# EAGLE design hat (EAGLE 7.7.0)

## Sheet 1 of 2
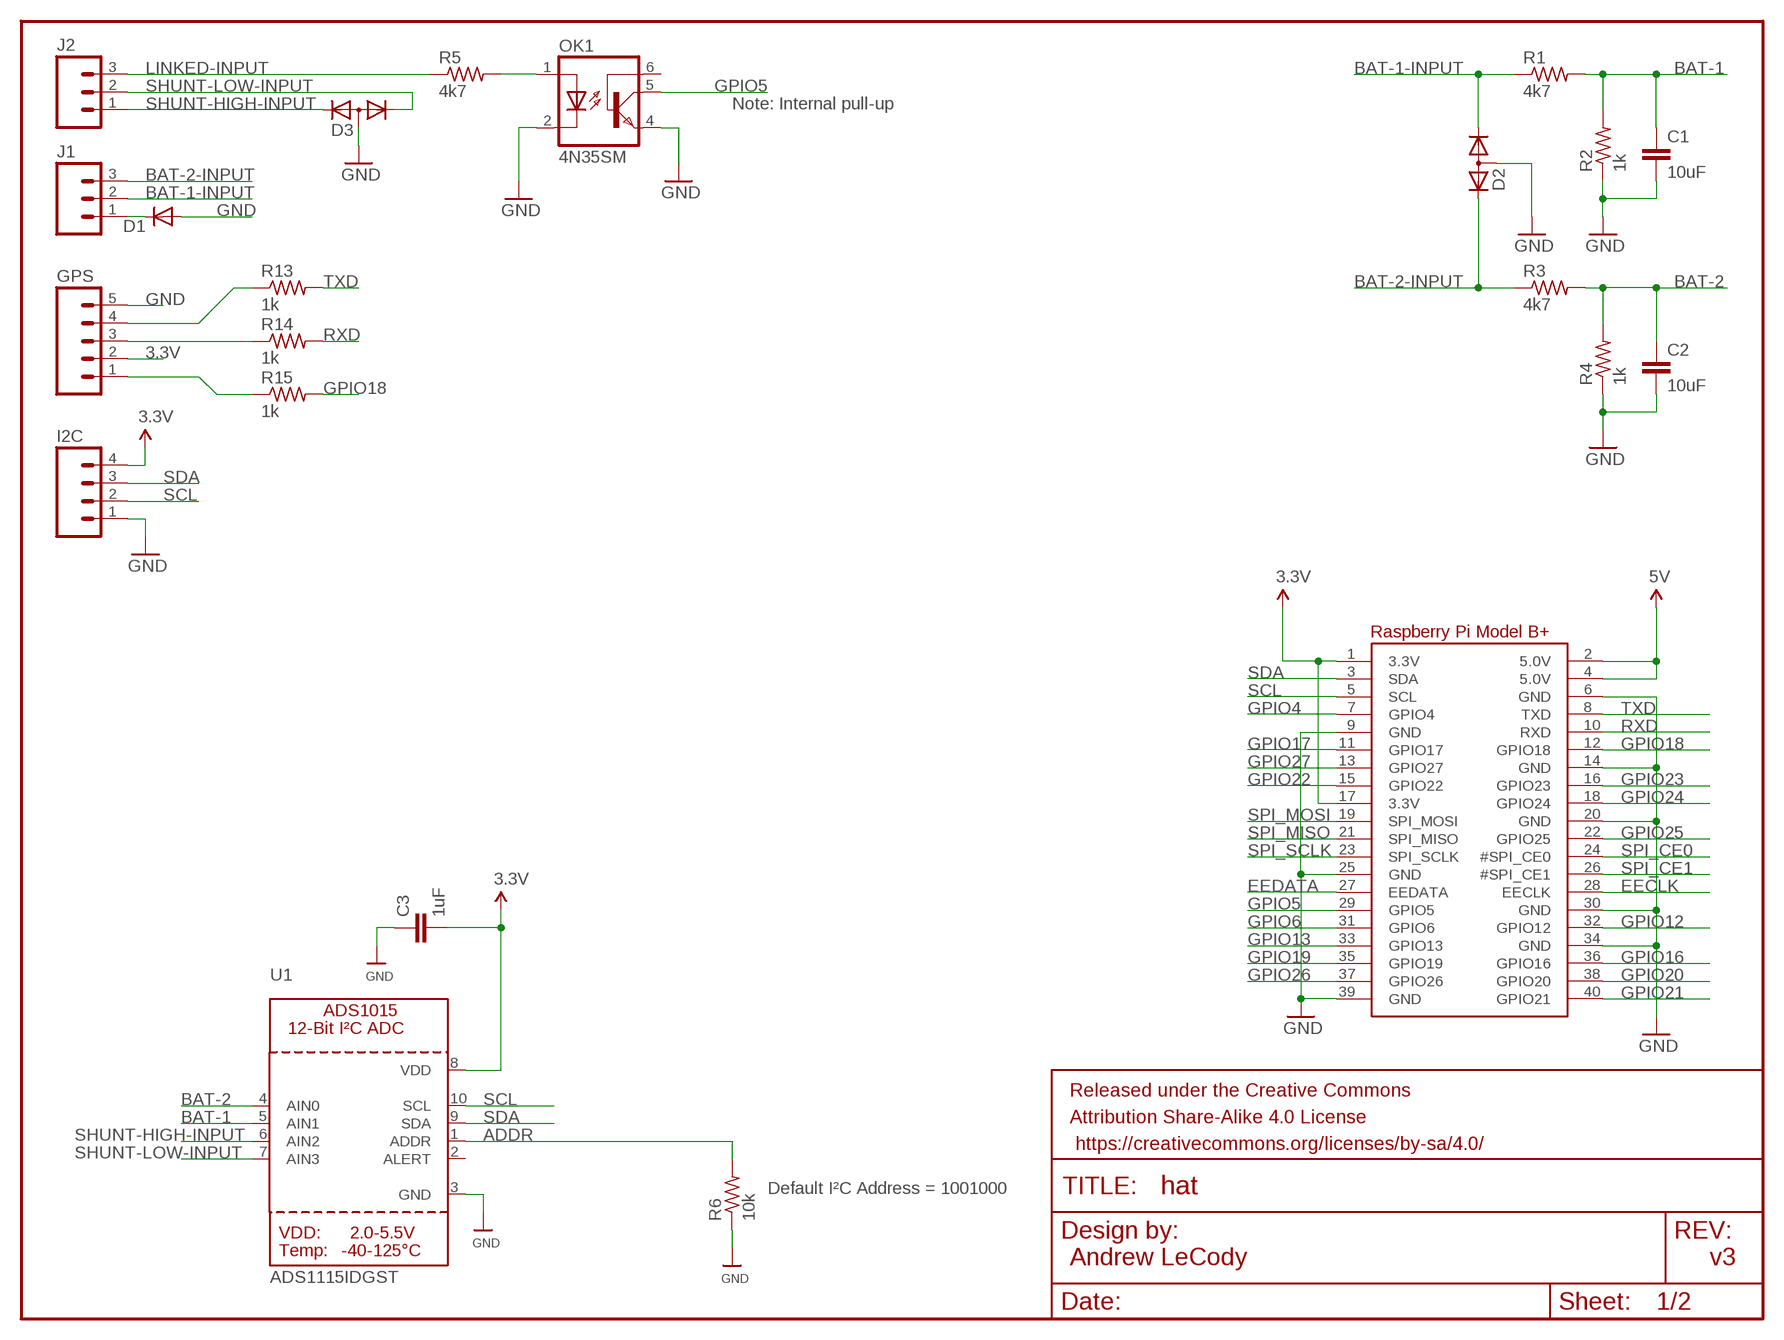
[diagram p0: schematic, sheet 1]

### Parts
C1  10uF  CAPACITOR_C0805  [C0805]
C2  10uF  CAPACITOR_C0805  [C0805]
C3  1uF  CAPACITOR_C0805  [C0805]
D1  DIODE-DO214AC  [DO214AC]
D2  DIODE-2CA|ACSOT23  [SOT23]
D3  DIODE-2CA|ACSOT23  [SOT23]
FRAME1  FRAME-LETTERNO_PACKAGE  [DUMMY]
GPS  M05PTH  [1X05]
I2C  M04PTH  [1X04]
J1  M03SCREW  [SCREWTERMINAL-3.5MM-3]
J2  M03SCREW  [SCREWTERMINAL-3.5MM-3]
OK1  4N35SM  [DIL6-SMD]
R1  4k7  RESISTOR_R0805  [R0805]
R2  1k  RESISTOR_R0805  [R0805]
R3  4k7  RESISTOR_R0805  [R0805]
R4  1k  RESISTOR_R0805  [R0805]
R5  4k7  RESISTOR_R0805  [R0805]
R6  10k  RESISTOR_R0805  [R0805]
R13  1k  RESISTOR_R0805  [R0805]
R14  1k  RESISTOR_R0805  [R0805]
R15  1k  RESISTOR_R0805  [R0805]
RPI1  RASPBERRYPI_BPLUS_HATNOSLOTS  [PI_HAT_NOSLOTS]
U1  ADS1115IDGST  ADC_ADS1015  [MSOP10]

### Nets
3.3V: C3.2 GPS.2 I2C.4 RPI1.1(3.3V) RPI1.17(3.3V) U1.8(VDD) ; also sheet 2
5V: RPI1.2(5.0V) RPI1.4(5.0V) ; also sheet 2
ADDR: R6.2 U1.1(ADDR)
BAT-1: C1.1 R1.2 R2.2 U1.5(AIN1)
BAT-1-INPUT: D2.1(K1) J1.2 R1.1
BAT-2: C2.1 R3.2 R4.2 U1.4(AIN0)
BAT-2-INPUT: D2.2(K2) J1.3 R3.1
EECLK: RPI1.28(EECLK)
EEDATA: RPI1.27(EEDATA)
GND: C1.2 C2.2 C3.1 D1.A D2.3(A) D3.3(A) GPS.5 I2C.1 OK1.2(C) OK1.4(EMI) R2.1 R4.1 R6.1 RPI1.6(GND) RPI1.9(GND) RPI1.14(GND) RPI1.20(GND) RPI1.25(GND) RPI1.30(GND) RPI1.34(GND) RPI1.39(GND) U1.3(GND) ; also sheet 2
GPIO4: RPI1.7(GPIO4)
GPIO5: OK1.5(COL) RPI1.29(GPIO5)
GPIO6: RPI1.31(GPIO6)
GPIO12: RPI1.32(GPIO12)
GPIO13: RPI1.33(GPIO13)
GPIO16: RPI1.36(GPIO16)
GPIO17: RPI1.11(GPIO17)
GPIO18: R15.2 RPI1.12(GPIO18)
GPIO19: RPI1.35(GPIO19)
GPIO20: RPI1.38(GPIO20)
GPIO21: RPI1.40(GPIO21)
GPIO22: RPI1.15(GPIO22)
GPIO23: RPI1.16(GPIO23)
GPIO24: RPI1.18(GPIO24)
GPIO25: RPI1.22(GPIO25) ; also sheet 2
GPIO26: RPI1.37(GPIO26)
GPIO27: RPI1.13(GPIO27)
LINKED-INPUT: J2.3 R5.1
N$1: GPS.4 R13.1
N$2: GPS.3 R14.1
N$3: OK1.1(A) R5.2
N$5: GPS.1 R15.1
RXD: R14.2 RPI1.10(RXD)
SCL: I2C.2 RPI1.5(SCL) U1.10(SCL)
SDA: I2C.3 RPI1.3(SDA) U1.9(SDA)
SHUNT-HIGH-INPUT: D3.2(K2) J2.1 U1.6(AIN2)
SHUNT-LOW-INPUT: D3.1(K1) J2.2 U1.7(AIN3)
SPI_CE0: RPI1.24(#SPI_CE0) ; also sheet 2
SPI_CE1: RPI1.26(#SPI_CE1)
SPI_MISO: RPI1.21(SPI_MISO) ; also sheet 2
SPI_MOSI: RPI1.19(SPI_MOSI) ; also sheet 2
SPI_SCLK: RPI1.23(SPI_SCLK) ; also sheet 2
TXD: R13.2 RPI1.8(TXD)
VEHICLE-GND: D1.C J1.1
Unconnected: OK1.6(BAS) U1.2(ALERT)

### Notes on the sheet
- Note: Internal pull-up
- Default I²C Address = 1001000
- Andrew LeCody | v3

## Sheet 2 of 2
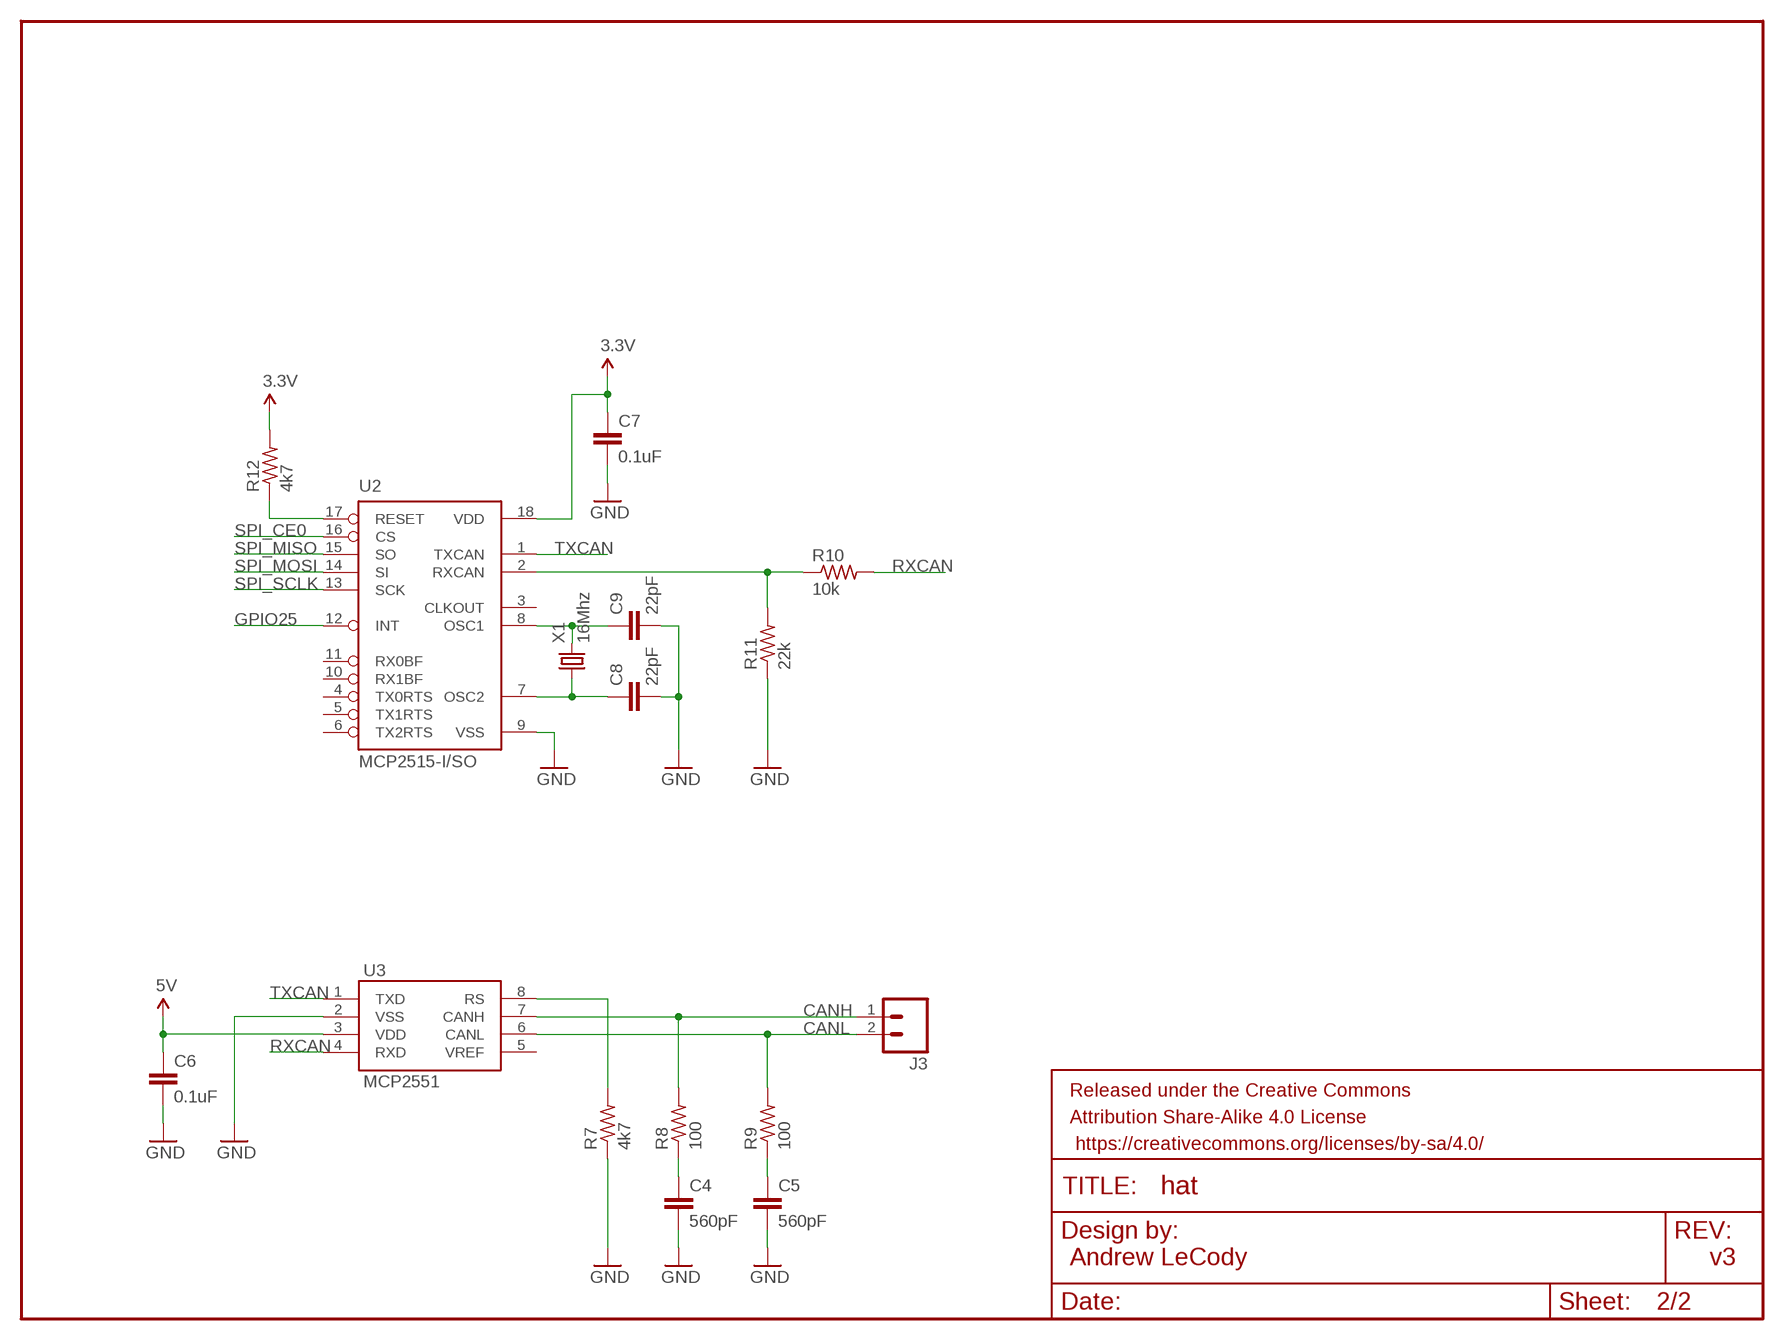
[diagram p1: schematic, sheet 2]

### Parts
C4  560pF  CAPACITOR_C0805  [C0805]
C5  560pF  CAPACITOR_C0805  [C0805]
C6  0.1uF  CAPACITOR_C0805  [C0805]
C7  0.1uF  CAPACITOR_C0805  [C0805]
C8  22pF  CAPACITOR_C0805  [C0805]
C9  22pF  CAPACITOR_C0805  [C0805]
FRAME2  FRAME-LETTERNO_PACKAGE  [DUMMY]
J3  M023.5MM  [SCREWTERMINAL-3.5MM-2]
R7  4k7  RESISTOR_R0805  [R0805]
R8  100  RESISTOR_R0805  [R0805]
R9  100  RESISTOR_R0805  [R0805]
R10  10k  RESISTOR_R0805  [R0805]
R11  22k  RESISTOR_R0805  [R0805]
R12  4k7  RESISTOR_R0805  [R0805]
U2  MCP2515-I/SO  [SO18L]
U3  MCP2551  [SO08]
X1  16Mhz  CRYSTALS-NOGND-4-HSMX  [HC49-4-HSMX]

### Nets
3.3V: C7.1 R12.2 U2.18(VDD) ; also sheet 1
5V: C6.1 U3.3(VDD) ; also sheet 1
CANH: J3.1 R8.2 U3.7(CANH)
CANL: J3.2 R9.2 U3.6(CANL)
GND: C4.2 C5.2 C6.2 C7.2 C8.2 C9.2 R7.1 R11.1 U2.9(VSS) U3.2(VSS) ; also sheet 1
GPIO25: U2.12(INT) ; also sheet 1
N$4: R10.1 R11.2 U2.2(RXCAN)
N$6: C4.1 R8.1
N$8: C5.1 R9.1
N$14: C9.1 U2.8(OSC1) X1.2
N$15: C8.1 U2.7(OSC2) X1.1
RS: R7.2 U3.8(RS)
RXCAN: R10.2 U3.4(RXD)
SPI_CE0: U2.16(CS) ; also sheet 1
SPI_MISO: U2.15(SO) ; also sheet 1
SPI_MOSI: U2.14(SI) ; also sheet 1
SPI_SCLK: U2.13(SCK) ; also sheet 1
TXCAN: U2.1(TXCAN) U3.1(TXD)
U2_RST: R12.1 U2.17(RESET)
Unconnected: U2.3(CLKOUT) U2.4(TX0RTS) U2.5(TX1RTS) U2.6(TX2RTS) U2.10(RX1BF) U2.11(RX0BF) U3.5(VREF)

### Notes on the sheet
- Andrew LeCody | v3

## Library data of the parts
C1-C9 = aceat64-passives:CAPACITOR_: CAPACITOR
D1 = diode:DIODE-: DIODE
D2 D3 = diode:DIODE-2CA|AC: Dual DIODE Cathode-Anode|Anode-Cathode
FRAME1 FRAME2 = SparkFun-Aesthetics:FRAME-LETTER: Schematic Frame Standard 8.5x11 US Letter frame; DESIGNER: Nobody; VERSION: v01
GPS = SparkFun-Connectors:M05: Header 5 Standard 5-pin 0.1" header. Use with straight break away headers (SKU : PRT-00116), right angle break away headers (PRT-00553), swiss pins (PRT-00743), machine pins (PRT-00117), and female headers (PRT-00115). Molex polarized connector foot print use with SKU : PRT-08230 with associated crimp pins and housings.
I2C = SparkFun-Connectors:M04: Header 4 Standard 4-pin 0.1" header. Use with straight break away headers (SKU : PRT-00116), right angle break away headers (PRT-00553), swiss pins (PRT-00743), machine pins (PRT-00117), and female headers (PRT-00115). Molex polarized connector foot print use with SKU : PRT-08231 with associated crimp pins and housings. 1MM SMD Version SKU: PRT-10208; PROD_ID: CONN-09696
J1 J2 = SparkFun-Connectors:M03: Header 3 Standard 3-pin 0.1" header. Use with straight break away headers (SKU : PRT-00116), right angle break away headers (PRT-00553), swiss pins (PRT-00743), machine pins (PRT-00117), and female headers (PRT-00115). Molex polarized connector foot print use with SKU : PRT-08232 with associated crimp pins and housings.; PROD_ID: CONN-08288
J3 = SparkFun-Connectors:M02: Standard 2-pin 0.1" header. Use with - straight break away headers ( PRT-00116) - right angle break away headers (PRT-00553) - swiss pins (PRT-00743) - machine pins (PRT-00117) - female headers (PRT-00115) Molex polarized connector foot print use with: PRT-08233 with associated crimp pins and housings. 2.54_SCREWTERM for use with PRT-10571. 3.5mm Screw Terminal footprints for PRT-08084 5mm Screw Terminal footprints for use with PRT-08432; PROD_ID: CONN-08399
OK1 = optocoupler:4N*?M: General Purpose 6-Pin Phototransistor Optocouplers Source: http://www.fairchildsemi.com/ds/4N/4N35-M.pdf; MF: FAIRCHILD SEMICONDUCTOR; MPN: 4N35S-M; OC_FARNELL: 1021179; OC_NEWARK: 67K2285
R1-R4 = aceat64-resistor:RESISTOR_: RESISTOR, American symbol
R5-R15 = aceat64-passives:RESISTOR_: RESISTOR, American symbol
RPI1 = microbuilder:RASPBERRYPI_BPLUS
U1 = microbuilder:ADC_ADS1015: ADS1015 - 12-bit 4-Channel I2C ADC with Internal PGA VDD: 2.0-5.5V Sampling Rate: 3.3ksps Gain Settings: 2/3, 1, 2, 4, 8, 16 I2C Address: ADDR low = 1001000x, ADDR high = 1001001x Internal Comparator The ADS1015 includes an internal comparator that can be set to output a high-level on ALERT when the conversion results exceeeds a pre-defined upper level, and will deassert itself when the level falls below a pre-defined lower threshold level. It can also be set to windowed mode where the ALERT pin will be asserted if the data exceeds the upper threshold or falls below the lower threshold.
U2 = mcp2515:MCP2515
U3 = SparkFun-DigitalIC:MCP2551: CAN transceiver; PROD_ID: IC-09907
X1 = IQD-Frequency-Products:CRYSTALS-NOGND: CRYSTALS CAN NOT GROUNDED

## Board
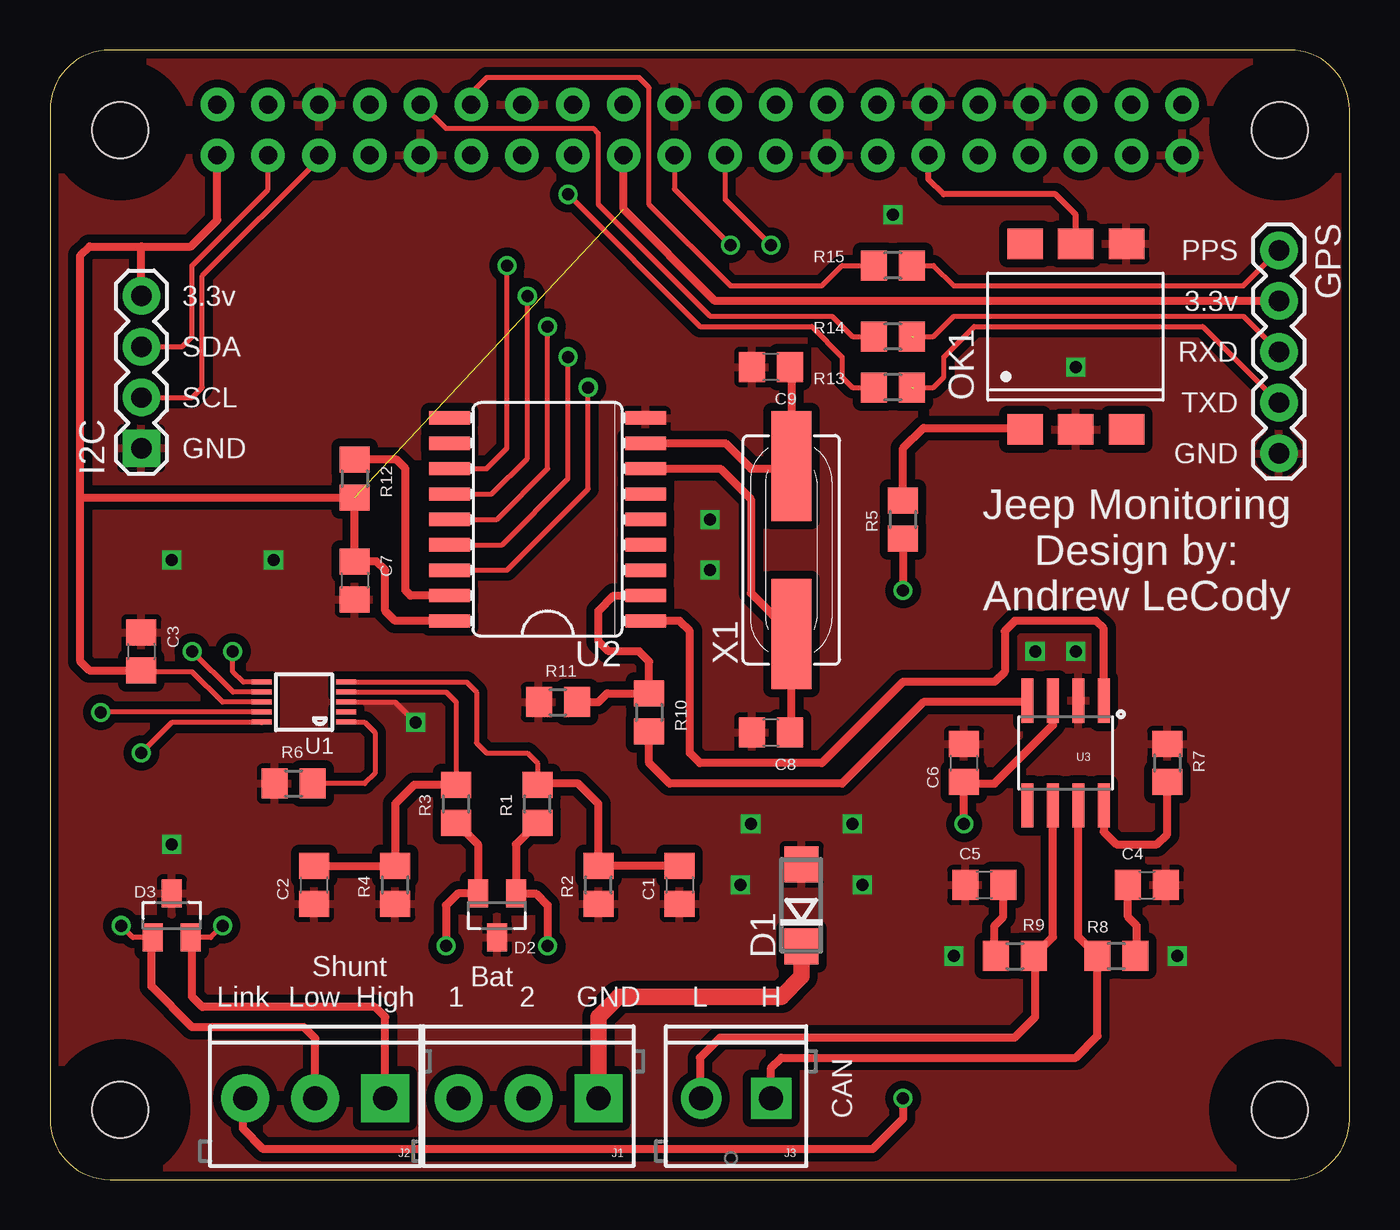
[diagram p2: board, top side]
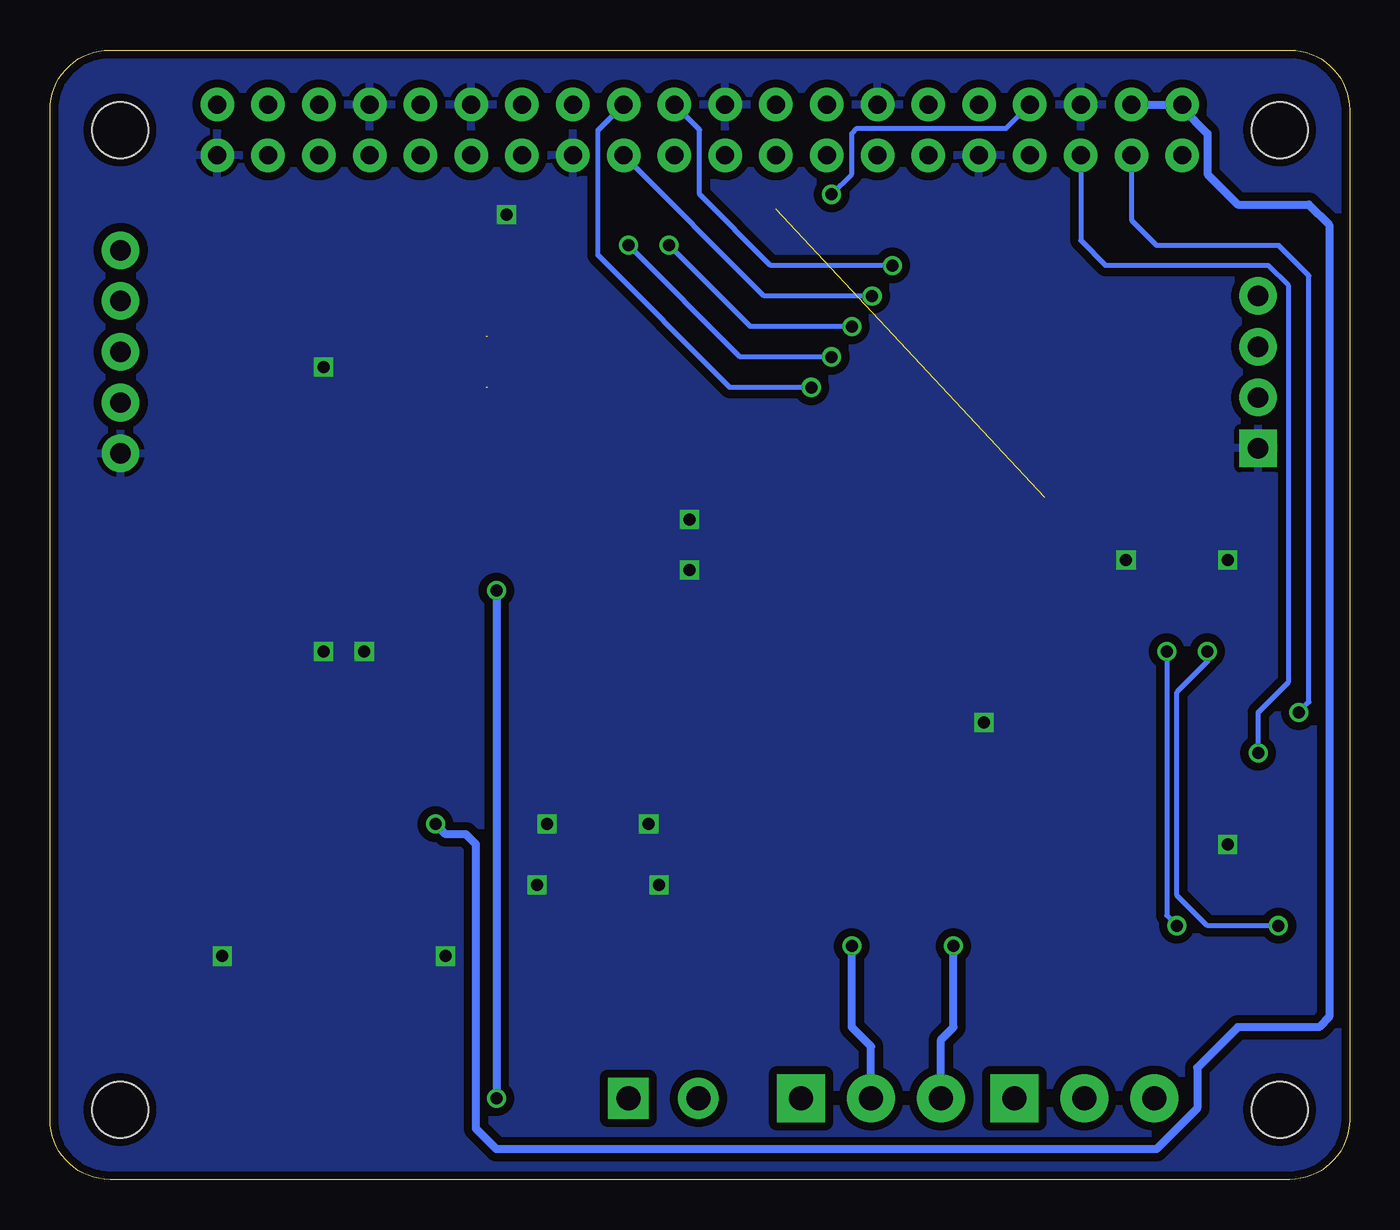
[diagram p3: board, bottom side, seen from below]

Size 65 x 56.5 mm. Coordinates in mm from the lower left corner, seen from the top.
Copper layers (1*16): Top 0.0356mm / dielectric 1.5011mm / Bottom 0.0356mm
Design rules "oshpark-2layer": minimum track width 6mil, minimum drill 13mil, track to track 6mil, track to pad 6mil, pad to pad 6mil, via to via 6mil, smd to smd 6mil, copper to edge 15mil, drill to drill 6mil, minimum pad ring 7mil, minimum via ring 7mil, stop-mask expansion 2.5mil, vias tented up to drill 0mil, thermal gap 10mil

### Footprints (pad centres in the part's own frame; a part is rotated, then mirrored left to right if it is on the bottom)
C0805 = smd 1.3 x 1.5: 1 -0.95,0; 2 0.95,0
DO214AC = smd 1.8 x 1.7: A 2.05,0; C -2.05,0
SOT23 = smd 1 x 1.4: 1 -0.95,-1.1; 2 0.95,-1.1; 3 0,1.1
1X05 = drill 1.016 pad 1.88: 1 0,0; 2 2.54,0; 3 5.08,0; 4 7.62,0; 5 10.16,0
1X04 = drill 1.016 pad 1.88 square: 1 0,0 | drill 1.016 pad 1.88: 2 2.54,0; 3 5.08,0; 4 7.62,0
SCREWTERMINAL-3.5MM-3 = drill 1.2 pad 2.413 square: 1 0,0 | drill 1.2 pad 2.413: 2 3.5,0; 3 7,0
SCREWTERMINAL-3.5MM-2 = drill 1.2 pad 2.032 square: 1 0,0 | drill 1.2 pad 2.032: 2 3.5,0
DIL6-SMD = smd 1.78 x 1.52: 1 -2.54,-4.645; 2 0,-4.645; 3 2.54,-4.645; 4 2.54,4.645; 5 0,4.645; 6 -2.54,4.645
R0805 = smd 1.3 x 1.5: 1 -0.95,0; 2 0.95,0
PI_HAT_NOSLOTS = drill 0.9 pad 1.676: 1 8.37,51.23; 2 8.37,53.77; 3 10.91,51.23; 4 10.91,53.77; 5 13.45,51.23; 6 13.45,53.77; 7 15.99,51.23; 8 15.99,53.77; 9 18.53,51.23; 10 18.53,53.77; 11 21.07,51.23; 12 21.07,53.77; 13 23.61,51.23; 14 23.61,53.77; 15 26.15,51.23; 16 26.15,53.77; 17 28.69,51.23; 18 28.69,53.77; 19 31.23,51.23; 20 31.23,53.77; 21 33.77,51.23; 22 33.77,53.77; 23 36.31,51.23; 24 36.31,53.77; 25 38.85,51.23; 26 38.85,53.77; 27 41.39,51.23; 28 41.39,53.77; 29 43.93,51.23; 30 43.93,53.77; 31 46.47,51.23; 32 46.47,53.77; 33 49.01,51.23; 34 49.01,53.77; 35 51.55,51.23; 36 51.55,53.77; 37 54.09,51.23; 38 54.09,53.77; 39 56.63,51.23; 40 56.63,53.77 | hole 2.8: 3.5,3.5; 3.5,52.5; 61.5,52.5; 61.5,3.5
MSOP10 = smd 0.25 x 1: 1 -1,-2.113; 2 -0.5,-2.113; 3 0,-2.113; 4 0.5,-2.113; 5 1,-2.113; 6 1,2.113; 7 0.5,2.113; 8 0,2.113; 9 -0.5,2.113; 10 -1,2.113
SO18L = smd 0.66 x 2.032: 1 -5.08,-4.902; 2 -3.81,-4.902; 3 -2.54,-4.902; 4 -1.27,-4.902; 5 0,-4.902; 6 1.27,-4.902; 7 2.54,-4.902; 8 3.81,-4.902; 9 5.08,-4.902; 10 5.08,4.902; 11 3.81,4.902; 12 2.54,4.902; 13 1.27,4.902; 14 0,4.902; 15 -1.27,4.902; 16 -2.54,4.902; 17 -3.81,4.902; 18 -5.08,4.902
SO08 = smd 0.61 x 2.21: 1 -1.905,-2.616; 2 -0.635,-2.616; 3 0.635,-2.616; 4 1.905,-2.616; 5 1.905,2.616; 6 0.635,2.616; 7 -0.635,2.616; 8 -1.905,2.616
HC49-4-HSMX = smd 5.5 x 2: 1 -4.2,0; 2 4.2,0

### Placement (x,y rotation side)
C1  31.5,14.73 270 top
C2  13.21,14.73 270 top
C3  4.57,26.42 270 top
C4  54.86,14.73 0 top
C5  46.74,14.73 180 top
C6  45.72,20.83 90 top
C7  15.24,29.97 270 top
C8  36.07,22.35 180 top
C9  36.07,40.64 180 top
D1  37.59,13.72 90 top
D2  22.35,13.21 180 top
D3  6.1,13.21 0 top
FRAME1  0.51,0.25 0 top
FRAME2  0.51,0.51 0 top
GPS  61.47,46.48 270 top
I2C  4.57,36.58 90 top
J1  27.43,4.06 180 top
J2  16.76,4.06 180 top
J3  36.07,4.06 180 top
OK1  51.31,42.16 0 top
R1  24.38,18.8 90 top
R2  27.43,14.73 90 top
R3  20.32,18.8 90 top
R4  17.27,14.73 90 top
R5  42.67,33.02 90 top
R6  12.19,19.81 0 top
R7  55.88,20.83 270 top
R8  53.34,11.18 180 top
R9  48.26,11.18 0 top
R10  29.97,23.37 270 top
R11  25.4,23.88 0 top
R12  15.24,35.05 270 top
R13  42.16,39.62 180 top
R14  42.16,42.16 180 top
R15  42.16,45.72 180 top
RPI1  0,0 0 top
U1  12.7,23.88 90 top
U2  24.89,33.02 90 top
U3  50.8,21.34 180 top
X1  37.08,31.5 90 top

### Tracks (layer width: path | path; a pad name or v marks a point on that pad's centre or on a via)
3.3V  (1 unrouted)
  Top 0.254: U1.8 8.64,23.88 7.11,25.4 4.64,25.4 C3.2
  Top 0.406: GPS.2 33.27,43.94 28.69,48.53 RPI1.17 | RPI1.1 8.37,47.99 7.05,46.67 4.57,46.67 | 4.57,46.67 1.97,46.67 1.52,46.23 1.52,34.04 | 1.52,34.04 1.52,25.91 1.97,25.47 C3.2 | 1.52,34.04 1.59,34.1 R12.2 C7.1 16.32,30.92 16.76,30.48 16.76,28.45 17.27,27.94 U2.18 | I2C.4 4.57,46.67
5V  (via drill 0.6)
  Top 0.406: v45.72,17.78 C6.1 45.79,19.81 47.24,19.81 50.16,22.73 U3.3
  Bottom 0.406: v45.72,17.78 45.21,17.27 44.2,17.27 43.69,16.76 43.69,2.54 42.67,1.52 9.65,1.52 7.62,3.56 7.62,5.59 5.59,7.62 1.52,7.62 1.02,8.13 1.02,47.75 2.03,48.77 5.59,48.77 7.11,50.29 7.11,52.32 8.37,53.58 RPI1.2 RPI1.4
ADDR
  Top 0.254: U1.1 15.73,22.88 16.26,22.35 16.26,20.32 15.75,19.81 R6.2
BAT-1
  Top 0.254: U1.5 20.84,24.88 21.34,24.38 21.34,21.84 21.84,21.34 23.88,21.34 24.38,20.83 R1.2
  Top 0.406: R1.2 24.45,19.81 26.42,19.81 27.43,18.8 R2.2 C1.1
BAT-1-INPUT  (via drill 0.6)
  Top 0.406: v24.89,11.68 24.89,13.72 24.3,14.31 D2.1 23.3,16.76 R1.1
  Bottom 0.406: J1.2 23.93,6.66 24.89,7.62 v24.89,11.68
BAT-2
  Top 0.254: U1.4 19.82,24.38 20.32,23.88 R3.2
  Top 0.406: C2.1 R4.2 17.27,18.8 18.22,19.75 R3.2
BAT-2-INPUT  (via drill 0.6)
  Top 0.406: v19.81,11.68 19.81,13.72 20.4,14.31 D2.2 21.4,16.76 R3.1
  Bottom 0.406: J1.3 20.43,7 19.81,7.62 v19.81,11.68
CANH
  Top 0.406: J3.1 36.07,5.59 36.58,6.1 51.31,6.1 52.39,7.18 R8.2 51.44,12.13 U3.7
CANL
  Top 0.406: J3.2 32.51,4.12 32.51,6.1 33.53,7.11 48.26,7.11 49.28,8.13 49.28,11.11 R9.2 50.16,12.13 U3.6
GND  (via drill 0.6)
  Top 0.254: U1.3 17.27,23.88 v18.29,22.86
  other vias: 33.02,33.02 33.02,30.48 49.28,26.42 51.31,26.42 40.13,17.78 35.05,17.78 34.54,14.73 6.1,30.99 11.18,30.99 6.1,16.76 45.21,11.18 56.39,11.18 40.64,14.73 51.31,40.64 42.16,48.26
  pour Bottom (isolate 0.406): 66.04,-1.27 66.04,57.15 -1.27,57.15 -1.27,-1.27
  pour Top (isolate 0.406): -1.78,57.66 66.55,57.66 66.55,-1.78 -1.78,-1.78
GPIO5
  Top 0.305: OK1.5 51.31,48.26 50.29,49.28 44.7,49.28 43.93,50.05 RPI1.29
GPIO18
  Top 0.254: RPI1.12 21.07,54.34 21.84,55.12 29.46,55.12 29.97,54.61 29.97,48.77 34.04,44.7 38.61,44.7 39.62,45.72 R15.2
GPIO25  (via drill 0.6)
  Top 0.254: U2.12 21.84,35.56 22.86,36.58 v22.86,45.72
  Bottom 0.254: RPI1.22 32.51,52.51 32.51,49.28 28.96,45.72 v22.86,45.72
LINKED-INPUT  (via drill 0.6)
  Top 0.406: R5.1 v42.67,29.46 | v42.67,4.06 42.67,3.05 41.15,1.52 10.67,1.52 9.65,2.54 9.65,3.95 J2.3
  Bottom 0.406: v42.67,29.46 v42.67,4.06
N$1  (1 unrouted)
  Top 0.254: GPS.4 57.78,42.55 57.66,42.67 46.23,42.67 44.7,41.15 44.7,40.13 44.2,39.62 43.18,39.62
N$2  (1 unrouted)
  Top 0.254: GPS.3 59.69,43.18 45.21,43.18 44.2,42.16 43.18,42.16
N$3
  Top 0.406: R5.2 42.67,36.58 43.69,37.59 48.7,37.59 OK1.1
N$4
  Top 0.406: U2.2 28.19,29.21 27.43,28.45 27.43,26.92 27.94,26.42 29.46,26.42 29.97,25.91 R10.1 27.87,24.32 27.43,23.88 R11.2
N$5
  Top 0.254: R15.1 44.2,45.72 45.21,44.7 59.69,44.7 GPS.1
N$6
  Top 0.406: R8.1 53.91,11.36 54.36,11.8 54.36,12.7 53.91,13.14 C4.1
N$8
  Top 0.406: R9.1 47.24,11.24 47.24,12.7 47.69,13.14 C5.1
N$14
  Top 0.406: U2.8 33.78,36.83 35.05,35.56 36.95,35.56 X1.2 37.08,40.57 C9.1
N$15
  Top 0.406: U2.7 33.53,35.56 35.05,34.04 35.05,29.33 X1.1 37.08,22.42 C8.1
RS
  Top 0.406: U3.8 52.7,17.4 53.34,16.76 55.37,16.76 55.88,17.27 R7.2
RXCAN
  Top 0.406: U3.4 48.82,23.88 43.69,23.88 39.62,19.81 30.99,19.81 29.97,20.83 R10.2
RXD
  Top 0.254: RPI1.10 18.62,53.77 19.81,52.58 27.18,52.58 27.43,52.32 27.43,48.77 33.02,43.18 39.12,43.18 40.13,42.16 R14.2
SCL  (via drill 0.6)
  Top 0.254: U1.10 10.57,22.86 6.1,22.86 v4.57,21.34 | I2C.2 7.11,39.12 7.62,39.62 7.62,45.21 13.45,51.04 RPI1.5
  Bottom 0.254: v4.57,21.34 4.57,23.37 3.05,24.89 3.05,44.7 4.06,45.72 12.19,45.72 13.45,46.98 RPI1.5
SDA  (via drill 0.6)
  Top 0.254: U1.9 v2.55,23.38 v2.54,23.37 | I2C.3 6.6,41.66 7.11,42.16 7.11,45.72 10.91,49.52 RPI1.3
  Bottom 0.254: v2.54,23.37 2.03,23.88 2.03,45.21 3.56,46.74 9.65,46.74 10.91,47.99 RPI1.3
SHUNT-HIGH-INPUT  (via drill 0.6)
  Top 0.254: U1.6 9.67,24.88 9.14,25.4 v9.14,26.42 | v8.64,12.7 8.04,12.11 D3.2
  Top 0.406: J2.1 16.76,8.13 16.26,8.64 7.62,8.64 7.11,9.14 7.11,12.04 D3.2
  Bottom 0.254: v9.14,26.42 9.14,13.21 v8.64,12.7
SHUNT-LOW-INPUT  (via drill 0.6)
  Top 0.254: U1.7 9.15,24.38 v7.11,26.42 | D3.1 4.15,12.11 v3.56,12.7
  Top 0.406: J2.2 13.26,7.06 12.7,7.62 7.11,7.62 5.08,9.65 5.08,12.04 D3.1
  Bottom 0.254: v7.11,26.42 7.11,25.91 8.64,24.38 8.64,14.22 7.11,12.7 v3.56,12.7
SPI_CE0  (via drill 0.6)
  Top 0.254: U2.16 22.86,30.48 26.92,34.54 v26.92,39.62
  Bottom 0.254: RPI1.24 37.59,52.49 37.59,46.23 30.99,39.62 v26.92,39.62
SPI_MISO  (via drill 0.6)
  Top 0.254: U2.15 22.61,31.75 25.91,35.05 v25.91,41.15 | v36.07,46.74 33.77,49.03 RPI1.21
  Bottom 0.254: v25.91,41.15 30.48,41.15 v36.07,46.74
SPI_MOSI  (via drill 0.6)
  Top 0.254: v34.04,46.74 31.23,49.54 RPI1.19 | U2.14 22.35,33.02 24.89,35.56 v24.89,42.67
  Bottom 0.254: v34.04,46.74 29.97,42.67 v24.89,42.67
SPI_SCLK  (via drill 0.6)
  Top 0.254: U2.13 22.1,34.29 23.88,36.07 v23.88,44.2
  Bottom 0.254: RPI1.23 29.28,44.2 v23.88,44.2
TXCAN
  Top 0.406: U3.1 52.7,27.56 52.32,27.94 48.26,27.94 47.75,27.43 47.75,25.4 47.24,24.89 42.67,24.89 38.61,20.83 32.51,20.83 32,21.34 32,27.43 31.5,27.94 U2.1
TXD  (via drill 0.6)
  Top 0.254: v25.91,49.28 32.51,42.67 38.1,42.67 39.62,41.15 39.62,40.13 40.13,39.62 R13.2
  Bottom 0.254: v25.91,49.28 24.89,50.29 24.89,52.32 24.64,52.58 17.18,52.58 RPI1.8
U2_RST
  Top 0.406: U2.17 18.03,29.21 17.78,29.46 17.78,35.56 17.34,36 R12.1
VEHICLE-GND
  Top 0.813: J1.1 27.43,8.13 28.45,9.14 36.58,9.14 37.59,10.16 D1.C

### Text on the board
tPlace: Jeep Monitoring / Design by: / Andrew LeCody | Shunt | Bat | Link | Low | High | 1 | 2 | GND | L | H | CAN
tNames: PPS | 3.3v | 3.3v | SDA | RXD | SCL | TXD | GND | GND